# EAGLE design remotoPro1.3 (EAGLE 7.6.0)
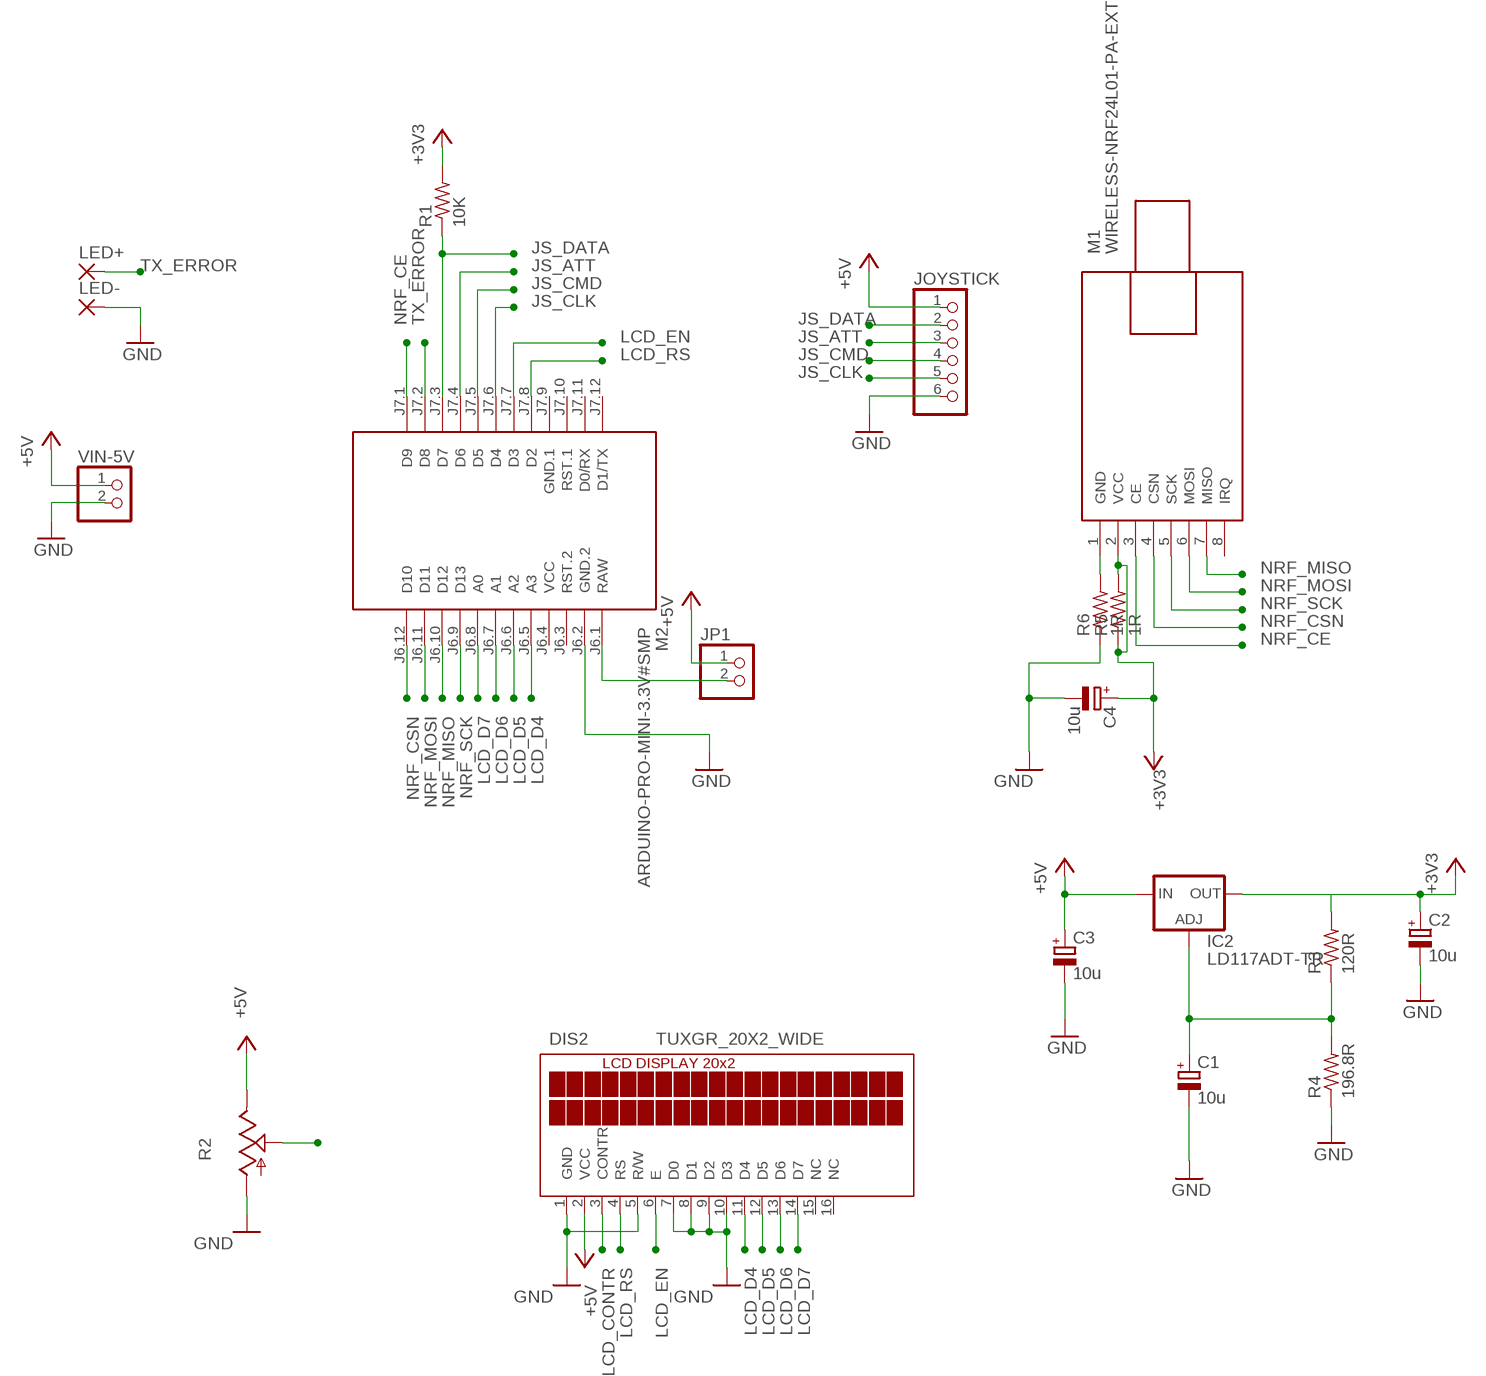
[diagram p0: schematic, sheet 1]

## Parts
C1  10u  CPOL-EUE1.8-4  [E1,8-4]
C2  10u  CPOL-EUE1.8-4  [E1,8-4]
C3  10u  CPOL-EUE1.8-4  [E1,8-4]
C4  10u  CPOL-EUE1.8-4  [E1,8-4]
DIS2  TUXGR_20X2_WIDE  [TUXGR_20X2_WIDE]
IC2  LD117ADT-TR  [DPACK]
JOYSTICK  PINHD-1X6  [1X06]
JP1  PINHD-1X2  [1X02]
LED+  1,6/0,8  [1,6/0,8]
LED-  1,6/0,8  [1,6/0,8]
M1  WIRELESS-NRF24L01-PA-EXT  [WIRELESS-NRF24L01-PA-EXT]
M2  ARDUINO-PRO-MINI-3.3V#SMP  [ARDUINO-PRO-MINI#SMP]
R1  10K  R-US_0204/7  [0204/7]
R2  TRIM_US-S75P  [S75P]
R3  120R  R-US_0204/7  [0204/7]
R4  196.8R  R-US_0204/7  [0204/7]
R5  1R  R-US_0207/2V  [0207/2V]
R6  1R  R-US_0207/2V  [0207/2V]
VIN-5V  PINHD-1X2  [1X02]

## Nets
+3V3: C2.+ C4.+ IC2.4(OUT) M1.2(VCC) R1.2 R3.2 R5.1 R5.2
+5V: C3.+ DIS2.2(VCC) IC2.3(IN) JOYSTICK.1 JP1.1 R2.E VIN-5V.1
GND: C1.- C2.- C3.- C4.- DIS2.1(GND) DIS2.5(R/W) DIS2.7(D0) DIS2.8(D1) DIS2.9(D2) DIS2.10(D3) JOYSTICK.6 LED-.1(P) M2.J6.2(GND.2) R2.A R4.1 R6.1 VIN-5V.2
JS_ATT: JOYSTICK.3 M2.J7.4(D6)
JS_CLK: JOYSTICK.5 M2.J7.6(D4)
JS_CMD: JOYSTICK.4 M2.J7.5(D5)
JS_DATA: JOYSTICK.2 M2.J7.3(D7) R1.1
LCD_CONTR: DIS2.3(CONTR) R2.S
LCD_D4: DIS2.11(D4) M2.J6.5(A3)
LCD_D5: DIS2.12(D5) M2.J6.6(A2)
LCD_D6: DIS2.13(D6) M2.J6.7(A1)
LCD_D7: DIS2.14(D7) M2.J6.8(A0)
LCD_EN: DIS2.6(E) M2.J7.7(D3)
LCD_RS: DIS2.4(RS) M2.J7.8(D2)
N$1: JP1.2 M2.J6.1(RAW)
N$3: C1.+ IC2.1(ADJ) R3.1 R4.2
N$73: M1.1(GND) R6.2
NRF_CE: M1.3(CE) M2.J7.1(D9)
NRF_CSN: M1.4(CSN) M2.J6.12(D10)
NRF_MISO: M1.7(MISO) M2.J6.10(D12)
NRF_MOSI: M1.6(MOSI) M2.J6.11(D11)
NRF_SCK: M1.5(SCK) M2.J6.9(D13)
TX_ERROR: LED+.1(P) M2.J7.2(D8)
Unconnected: DIS2.15(NC) DIS2.16(NC) M1.8(IRQ) M2.J6.3(RST.2) M2.J7.10(RST.1) M2.J7.11(D0/RX) M2.J7.12(D1/TX)

## Power pins joined to a net without a drawn wire
GND.1: M2.J7.9(GND.1)
VCC: M2.J6.4(VCC)

## Library data of the parts
C1-C4 = rcl:CPOL-EU: POLARIZED CAPACITOR, European symbol
DIS2 = display-lcd:TUXGR_20X2_WIDE: Tuxgraphics LCD display 20x2 characters reflective, without background light Source: tuxgr_20x2.pdf
IC2 = v-reg:LD117A?*: Low drop fixed and adjustable positive voltage regulators 1 A Source: http://www.st.com/stonline/products/literature/ds/7194/ld1117axx.pdf
JOYSTICK = pinhead:PINHD-1X6: PIN HEADER
JP1 VIN-5V = pinhead:PINHD-1X2: PIN HEADER
LED+ LED- = wirepad:1,6/0,8: THROUGH-HOLE PAD
M1 = diy-modules:WIRELESS-NRF24L01-PA-EXT: 2.4 GHz Wireless Module based on NRF24L01 chip with preamplifier and external antenna Click here to find device on ebay.com <http://www.ebay.com/sch/nrf24l01+pa+lna+sma>
M2 = diy-modules:ARDUINO-PRO-MINI-*#SMP: Arduino Pro Mini (and compatible devices) with 2 connectors only More details available here: https://www.arduino.cc/en/Main/ArduinoBoardProMini Click here to find device on ebay.com <http://www.ebay.com/sch/arduino+pro+mini>
R1 R3-R6 = rcl:R-US_: RESISTOR, American symbol
R2 = pot:TRIM_US-: POTENTIOMETER

## Board
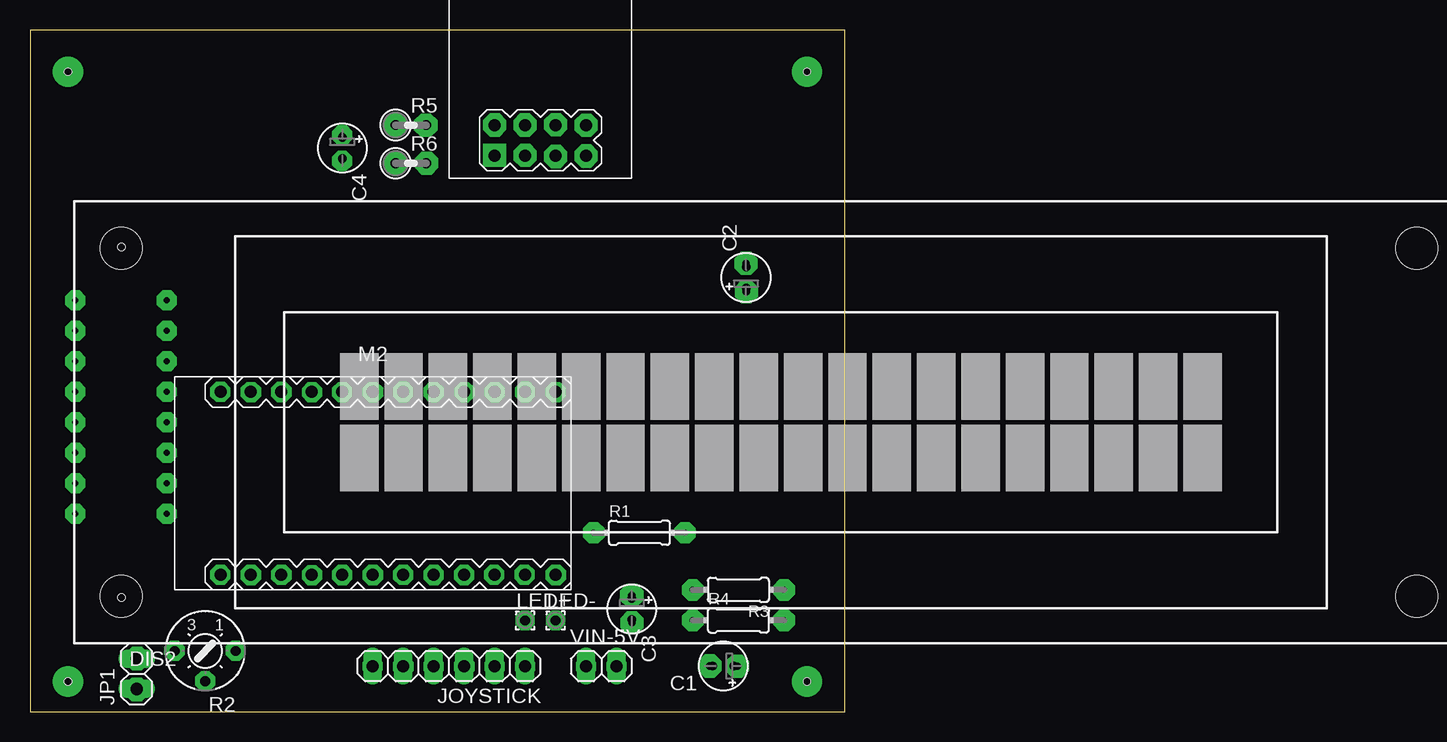
[diagram p1: board, top side]
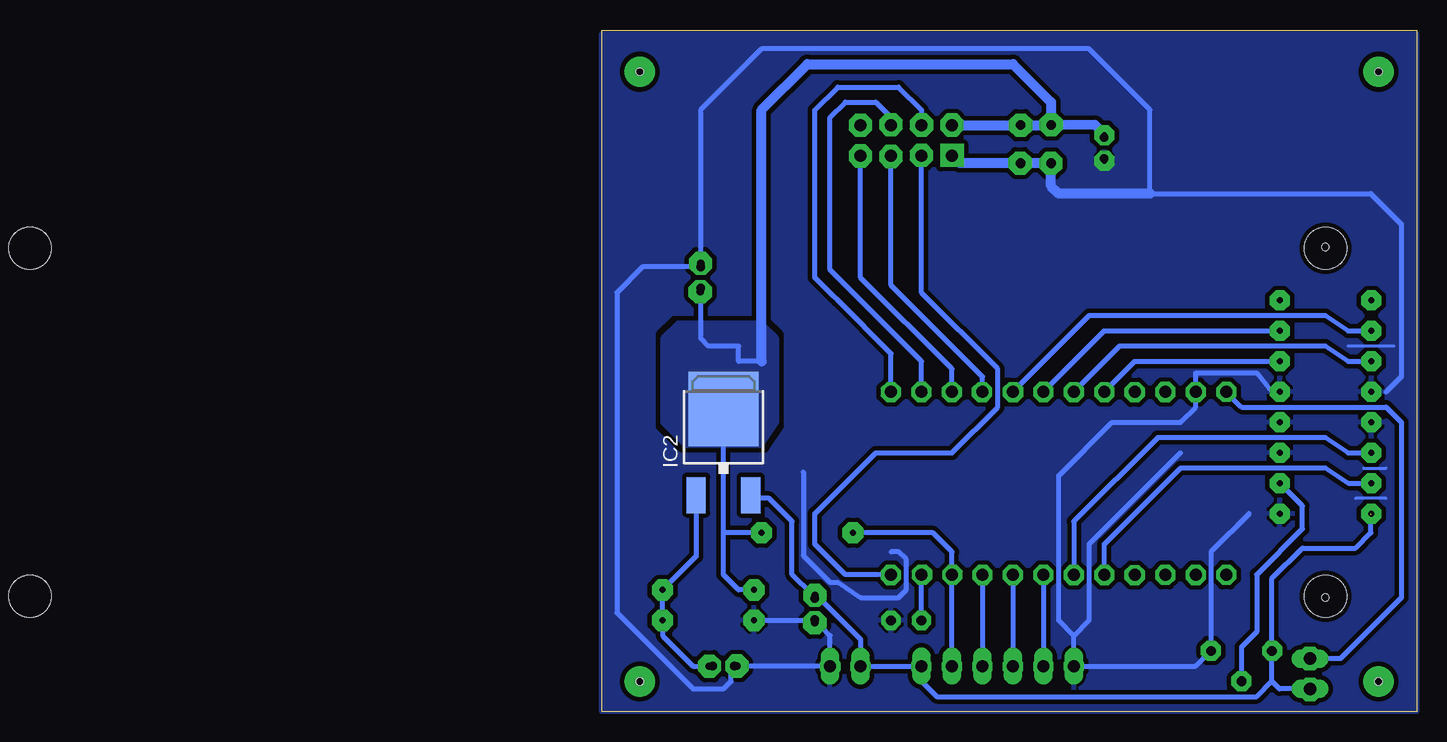
[diagram p2: board, bottom side, seen from below]

Size 67.93 x 56.82 mm. Coordinates in mm from the lower left corner, seen from the top.
Outline: 0,0 67.93,0 67.93,56.82 0,56.82 0,0
Copper layers (1*16): Top 0.035mm / dielectric 1.5mm / Bottom 0.035mm
Design rules "default *": minimum track width 10mil, minimum drill 24mil, track to track 8mil, track to pad 8mil, pad to pad 8mil, via to via 8mil, smd to smd 8mil, copper to edge 0mil, drill to drill 8mil, minimum pad ring 10mil, minimum via ring 8mil, stop-mask expansion 4mil, vias tented up to drill 0mil, thermal gap 10mil
Holes 0.6 mm at 3.17,53.34 7.62,38.73 7.62,9.53 64.77,2.54 64.77,53.34 3.17,2.54

### Footprints (pad centres in the part's own frame; a part is rotated, then mirrored left to right if it is on the bottom)
E1,8-4 = drill 0.711 pad 1.168: + -0.889,0 | drill 0.711 pad 1.168 octagon: - 0.889,0
TUXGR_20X2_WIDE = drill 0.5 pad 1.676 octagon: 1 -50.19,-7.62; 2 -57.81,-7.62; 3 -50.19,-5.08; 4 -57.81,-5.08; 5 -50.19,-2.54; 6 -57.81,-2.54; 7 -50.19,0; 8 -57.81,0; 9 -50.19,2.54; 10 -57.81,2.54; 11 -50.19,5.08; 12 -57.81,5.08; 13 -50.19,7.62; 14 -57.81,7.62; 15 -50.19,10.16; 16 -57.81,10.16 | hole 3.5: -54,-14.5; 54,-14.5; -54,14.5; 54,14.5
DPACK = smd 1.6 x 3: 1 -2.28,-4.8; 3 2.28,-4.8 | smd 5.8 x 6.2: 4 0,2.38
1X06 = drill 1.016 long: 1 -6.35,0; 2 -3.81,0; 3 -1.27,0; 4 1.27,0; 5 3.81,0; 6 6.35,0
1X02 = drill 1.016 long: 1 -1.27,0; 2 1.27,0
1,6/0,8 = drill 0.813 pad 1.6 octagon: 1 0,0
WIRELESS-NRF24L01-PA-EXT = drill 1 square: 1 -18.415,3.81 | drill 1: 2 -15.875,3.81; 3 -18.415,1.27; 4 -15.875,1.27; 5 -18.415,-1.27; 6 -15.875,-1.27; 7 -18.415,-3.81; 8 -15.875,-3.81
ARDUINO-PRO-MINI#SMP = drill 1: J6.1 -12.7,7.62; J6.2 -10.16,7.62; J6.3 -7.62,7.62; J6.4 -5.08,7.62; J6.5 -2.54,7.62; J6.6 0,7.62; J6.7 2.54,7.62; J6.8 5.08,7.62; J6.9 7.62,7.62; J6.10 10.16,7.62; J6.11 12.7,7.62; J6.12 15.24,7.62; J7.1 15.24,-7.62; J7.2 12.7,-7.62; J7.3 10.16,-7.62; J7.4 7.62,-7.62; J7.5 5.08,-7.62; J7.6 2.54,-7.62; J7.7 0,-7.62; J7.8 -2.54,-7.62; J7.9 -5.08,-7.62; J7.10 -7.62,-7.62; J7.11 -10.16,-7.62; J7.12 -12.7,-7.62
0204/7 = drill 0.5 pad 1.778 octagon: 1 -3.81,0; 2 3.81,0
S75P = drill 0.813 octagon: A -2.54,0; E 2.54,0; S 0,2.54
0207/2V = drill 0.813 octagon: 1 -1.27,0; 2 1.27,0

### Placement (x,y rotation side)
C1  57.78,3.81 180 top
C2  59.69,36.2 90 top
C3  50.16,8.57 270 top
C4  26.04,46.99 270 top
DIS2  61.6,24.13 0 top
IC2  57.78,22.86 0 bottom
JOYSTICK  34.92,3.81 180 top
JP1  8.89,3.17 90 top
LED+  41.27,7.62 0 top
LED-  43.81,7.62 0 top
M1  42.55,64.77 90 top
M2  28.58,19.05 0 top
R1  50.8,14.92 0 top
R2  14.61,5.08 180 top
R3  59.05,10.16 180 top
R4  59.05,7.62 0 top
R5  31.75,48.9 0 top
R6  31.75,45.72 0 top
VIN-5V  47.62,3.81 0 top

### Tracks (layer width: path | path; a pad name or v marks a point on that pad's centre or on a via)
+3V3
  Bottom 0.406: R3.2 56.52,10.16 57.78,11.43 57.78,14.92 | 54.61,29.21 56.52,29.21 56.52,30.48 59.05,30.48 59.69,31.11 C2.+ | 57.78,14.92 IC2.4 | R1.2 57.78,14.92
  Bottom 0.813: 54.61,29.21 54.61,50.16 50.8,53.98 33.66,53.98 30.48,50.8 R5.1 | R5.1 R5.2 M1.2 | C4.+ 26.18,48.27 26.81,48.9 R5.1
  pour Bottom (no thermals): 54.61,32.38 61.6,32.38 62.87,31.11 62.87,24.13 60.96,22.23 54.61,22.23 53.34,24.13 53.34,31.11
+5V  (1 unrouted)
  Bottom 0.406: 12.07,2.54 13.34,1.27 40.01,1.27 41.27,2.54 JOYSTICK.1 VIN-5V.1 46.35,6.03 49.78,9.46 C3.+ 50.42,9.78 52.07,11.43 52.07,15.88 53.98,17.78 55.23,17.78 IC2.3 | 12.07,2.54 R2.E 12.07,11.11 9.53,13.65 5.08,13.65 3.81,14.92 3.81,16.48 | JP1.1 11.43,1.91 12.07,2.54
GND  (via drill 0.5 pad 1.68)
  Bottom 0.254: 2.54,17.78 5.08,17.78 | 4.45,20.32 2.54,20.32 | 1.9,30.48 5.71,30.48
  Bottom 0.305: v26.02,45.92 C4.-
  Bottom 0.406: 13.97,16.51 17.14,13.34 R2.A 18.41,3.81 JOYSTICK.6 28.58,6.35 | 12.07,26.67 13.34,28.26 18.41,28.26 M2.J6.2 18.41,25.4 19.68,24.13 25.4,24.13 29.84,19.68 29.84,7.62 28.58,6.35 | R4.1 50.16,7.62 C3.- 48.9,6.35 VIN-5V.2 C1.- 57.15,3.56 57.15,2.54 57.78,1.91 60.32,1.91 66.68,8.26 66.68,34.92 64.52,37.08 C2.- 59.69,50.16 54.61,55.24 27.3,55.24 22.23,50.16 22.23,43.18 3.81,43.18 1.27,40.64 1.27,27.94 2.54,26.67 | 19.68,21.59 27.3,13.97 27.3,7.62 28.58,6.35 | 51.12,20 51.12,13.02 48.9,10.79 48.26,10.79 46.35,9.53 43.18,9.53 42.55,10.16 42.55,12.7 43.18,13.34 43.81,13.34
  Bottom 0.813: 22.23,43.18 29.84,43.18 30.48,43.81 R6.1
  pour Bottom (isolate 0.381, rank 2): 0,0 67.94,0 67.94,56.52 0,56.52
JS_ATT
  Bottom 0.406: M2.J7.4 JOYSTICK.3
JS_CLK
  Bottom 0.406: M2.J7.6 JOYSTICK.5
JS_CMD
  Bottom 0.406: M2.J7.5 JOYSTICK.4
JS_DATA
  Bottom 0.406: JOYSTICK.2 M2.J7.3 38.73,13.34 40.32,14.92 R1.1
LCD_CONTR
  Bottom 0.406: R2.S 14.61,5.4 13.34,6.67 13.34,11.43 9.53,15.24 9.53,17.17 DIS2.3
LCD_D4
  Bottom 0.406: M2.J6.5 23.5,29.21 DIS2.11
LCD_D5
  Bottom 0.406: M2.J6.6 24.77,30.48 7.59,30.48 5.71,29.21 DIS2.12
LCD_D6
  Bottom 0.406: M2.J6.7 26.04,31.75 DIS2.13
LCD_D7
  Bottom 0.406: M2.J6.8 27.3,33.02 7.59,33.02 5.71,31.75 DIS2.14
LCD_EN
  Bottom 0.406: M2.J7.7 28.58,15.88 21.59,22.86 7.59,22.86 5.71,21.59 DIS2.6
LCD_RS
  Bottom 0.406: M2.J7.8 26.04,13.97 19.68,20.32 7.59,20.32 5.71,19.05 DIS2.4
N$1
  Bottom 0.406: M2.J6.1 14.61,25.4 2.54,25.4 1.27,24.13 1.27,9.53 6.35,4.45 JP1.2
N$2  (via drill 0.6 pad 2.54)
  other vias: 3.17,53.34
N$3
  Bottom 0.406: IC2.1 60.07,12.96 R3.1 R4.2 62.87,6.35 60.32,3.81 C1.+
N$4  (via drill 0.6 pad 2.54)
  other vias: 64.77,53.34
N$5  (via drill 0.6 pad 2.54)
  other vias: 64.77,2.54
N$6  (via drill 0.6 pad 2.54)
  other vias: 3.17,2.54
N$7  (via drill 0.6 pad 1.93)
  other vias: 8.91,4.44
N$8  (via drill 0.6 pad 1.93)
  other vias: 8.89,1.86
N$9  (via drill 0.6 pad 1.93)
  other vias: 50.16,9.7
N$10  (via drill 0.6 pad 1.93)
  other vias: 50.18,7.42
N$11  (via drill 0.6 pad 1.93)
  other vias: 56.67,3.82
N$12  (via drill 0.6 pad 1.93)
  other vias: 58.96,3.8
N$13  (via drill 0.6 pad 1.93)
  other vias: 59.69,37.38
N$14  (via drill 0.6 pad 1.93)
  other vias: 59.72,35
N$15  (via drill 0.6 pad 1.93)
  other vias: 38.72,46.37
N$16  (via drill 0.6 pad 1.93)
  other vias: 38.74,48.9
N$17  (via drill 0.6 pad 1.93)
  other vias: 41.26,48.9
N$18  (via drill 0.6 pad 1.93)
  other vias: 43.82,48.93
N$19  (via drill 0.6 pad 1.93)
  other vias: 46.37,48.88
N$20  (via drill 0.6 pad 1.93)
  other vias: 41.28,46.37
N$21  (via drill 0.6 pad 1.93)
  other vias: 43.82,46.28
N$22  (via drill 0.6 pad 1.93)
  other vias: 46.37,46.32
N$23  (via drill 0.6 pad 1.93)
  other vias: 33.01,48.88
N$24  (via drill 0.6 pad 1.93)
  other vias: 30.46,48.93
N$25  (via drill 0.6 pad 1.93)
  other vias: 30.5,45.71
N$26  (via drill 0.6 pad 1.93)
  other vias: 33.06,45.72
N$27  (via drill 0.6 pad 1.68)
  other vias: 7.62,38.73
N$28  (via drill 0.5 pad 1.68)
  other vias: 26.03,48.05
N$29  (via drill 0.6 pad 1.68)
  other vias: 7.62,9.53
N$30  (via drill 0.6)
  other vias: 41.28,7.63
N$43  (via drill 0.6 pad 1.68)
  other vias: 15.86,26.66
N$44  (via drill 0.6 pad 1.68)
  other vias: 18.42,26.64
N$45  (via drill 0.6 pad 1.68)
  other vias: 20.96,26.65
N$46  (via drill 0.6 pad 1.68)
  other vias: 23.51,26.64
N$47  (via drill 0.6 pad 1.68)
  other vias: 26.03,26.64
N$48  (via drill 0.6 pad 1.68)
  other vias: 28.58,26.64
N$49  (via drill 0.6 pad 1.68)
  other vias: 31.12,26.65
N$50  (via drill 0.6 pad 1.68)
  other vias: 33.64,26.64
N$51  (via drill 0.6 pad 1.68)
  other vias: 15.86,11.42
N$52  (via drill 0.6 pad 1.68)
  other vias: 18.42,11.4
N$53  (via drill 0.6 pad 1.68)
  other vias: 20.96,11.41
N$54  (via drill 0.6 pad 1.68)
  other vias: 23.51,11.4
N$55  (via drill 0.6 pad 1.68)
  other vias: 26.03,11.4
N$56  (via drill 0.6 pad 1.68)
  other vias: 28.58,11.4
N$57  (via drill 0.6 pad 1.68)
  other vias: 31.12,11.41
N$58  (via drill 0.6 pad 1.68)
  other vias: 33.66,11.4
N$59  (via drill 0.6 pad 1.68)
  other vias: 36.23,26.64
N$60  (via drill 0.6 pad 1.68)
  other vias: 38.74,26.64
N$61  (via drill 0.6 pad 1.68)
  other vias: 41.28,26.65
N$62  (via drill 0.6 pad 1.68)
  other vias: 43.82,26.64
N$63  (via drill 0.6 pad 1.68)
  other vias: 36.19,11.4
N$64  (via drill 0.6 pad 1.68)
  other vias: 38.69,11.42
N$65  (via drill 0.6 pad 1.68)
  other vias: 41.22,11.44
N$66  (via drill 0.6 pad 1.68)
  other vias: 43.83,11.4
N$67  (via drill 0.6 pad 1.68)
  other vias: 28.56,3.8
N$68  (via drill 0.6 pad 1.68)
  other vias: 31.12,3.78
N$69  (via drill 0.6 pad 1.68)
  other vias: 33.66,3.79
N$70  (via drill 0.6 pad 1.68)
  other vias: 36.21,3.78
N$71  (via drill 0.6 pad 1.68)
  other vias: 38.73,3.78
N$72  (via drill 0.6 pad 1.68)
  other vias: 41.28,3.78
N$73
  Bottom 0.813: R6.2 38.1,45.72 M1.1
N$74  (via drill 0.6 pad 1.68)
  other vias: 46.36,3.78
N$75  (via drill 0.6 pad 1.68)
  other vias: 48.89,3.78
N$76
  Bottom 0.813: 31.12,45.72 32.38,45.72
N$77  (via drill 0.6 pad 1.68)
  other vias: 12.04,5.09
N$78  (via drill 0.6 pad 1.68)
  other vias: 17.14,5.1
N$79  (via drill 0.6 pad 1.68)
  other vias: 14.6,2.56
NRF_CE
  Bottom 0.406: M1.3 41.27,34.92 34.92,28.57 34.92,25.4 38.73,21.59 45.09,21.59 50.16,16.51 50.16,13.97 47.62,11.43 M2.J7.1
NRF_CSN
  Bottom 0.406: M1.4 41.27,50.16 43.18,52.07 48.26,52.07 50.16,50.16 50.16,36.2 48.58,34.61 48.26,34.29 43.81,29.84 M2.J6.12
NRF_MISO
  Bottom 0.406: M2.J6.10 38.73,28.57 46.35,36.2 M1.7
NRF_MOSI
  Bottom 0.406: M2.J6.11 41.27,29.21 48.9,36.83 48.9,49.53 47.62,50.8 45.09,50.8 43.81,49.53 M1.6
NRF_SCK
  Bottom 0.406: M2.J6.9 36.2,27.94 43.81,35.56 M1.5
TX_ERROR
  Bottom 0.406: LED+.1 M2.J7.2